# EAGLE schematic BreakoutBoard (EAGLE 9.6.2)
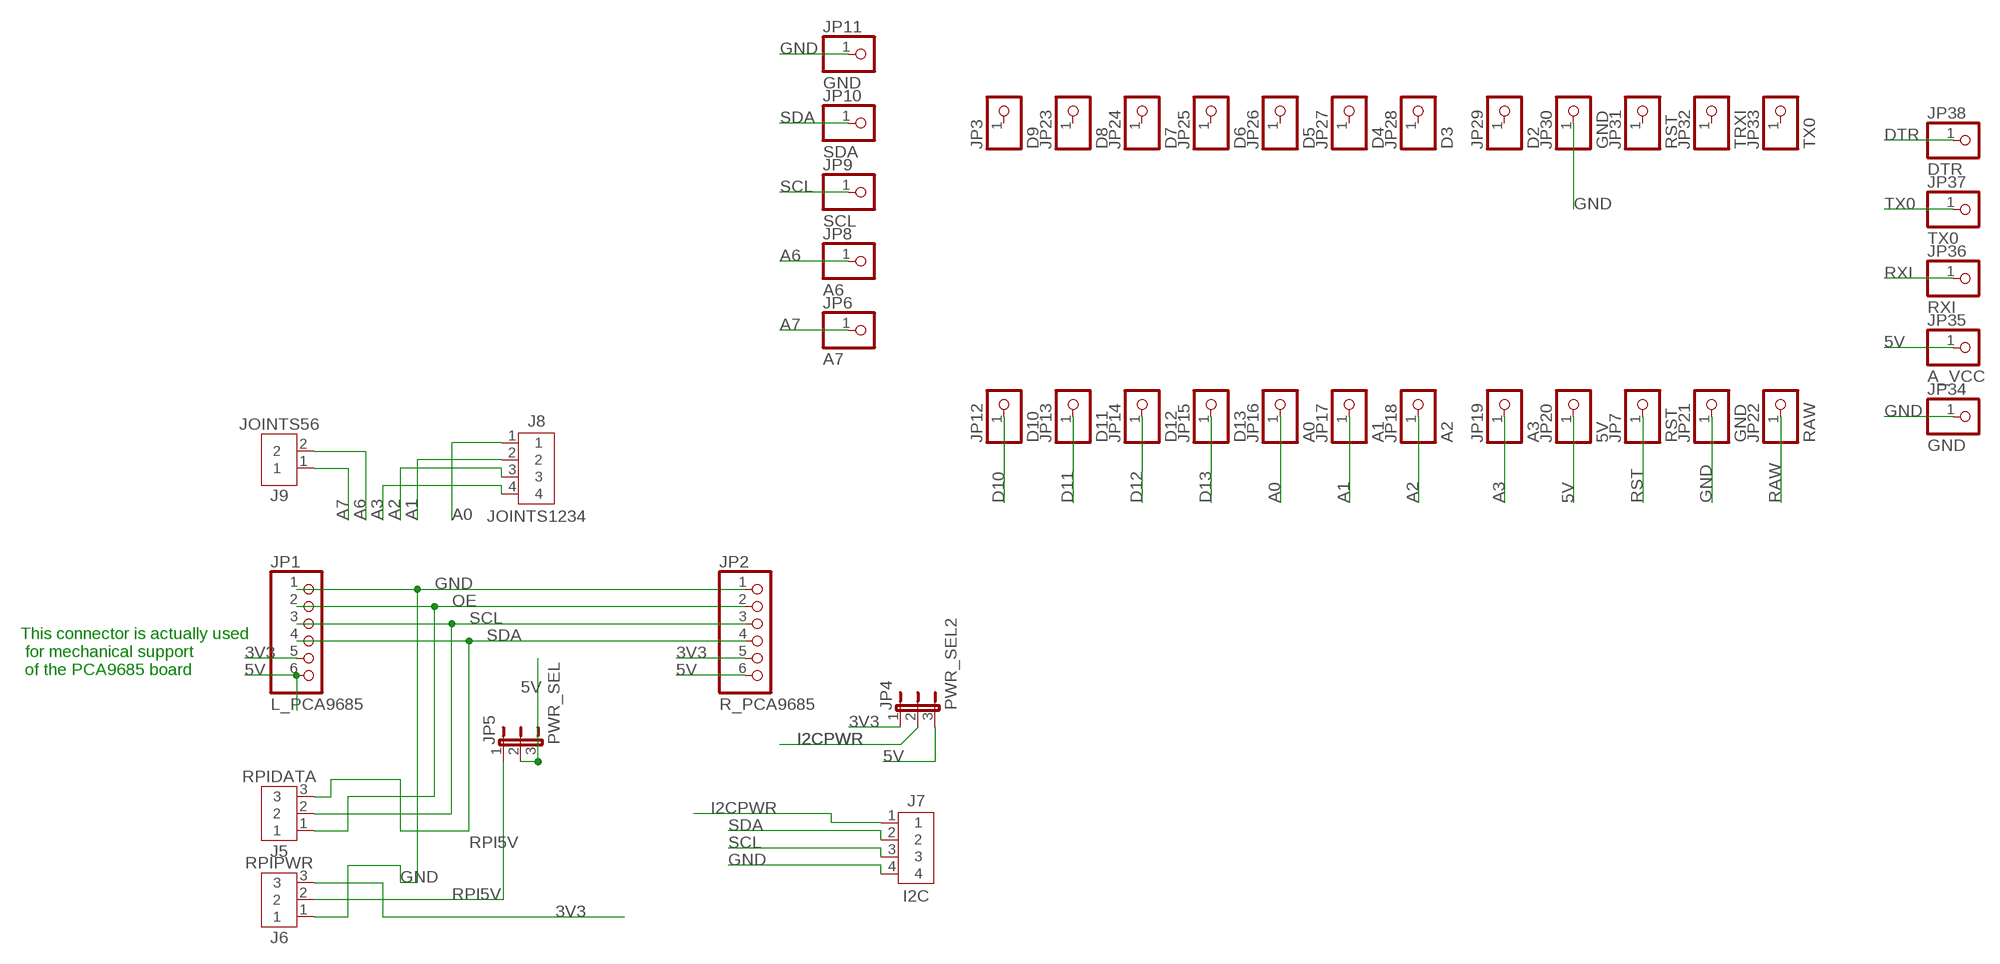
[diagram p0: schematic, sheet 1]

## Parts
J5  RPIDATA  B3B-XH-A  [B3B-XH-A]
J6  RPIPWR  B3B-XH-A  [B3B-XH-A]
J7  I2C  B4B-XH-A  [B4B-XH-A]
J8  JOINTS1234  B4B-XH-A  [B4B-XH-A]
J9  JOINTS56  B2B-XH-A  [B2B-XH-A]
JP1  L_PCA9685  PINHD-1X6  [1X06]
JP2  R_PCA9685  PINHD-1X6  [1X06]
JP3  D9  PINHD-1X1  [1X01]
JP4  PWR_SEL2  JP2E  [JP2]
JP5  PWR_SEL  JP2E  [JP2]
JP6  A7  PINHD-1X1  [1X01]
JP7  RST  PINHD-1X1  [1X01]
JP8  A6  PINHD-1X1  [1X01]
JP9  SCL  PINHD-1X1  [1X01]
JP10  SDA  PINHD-1X1  [1X01]
JP11  GND  PINHD-1X1  [1X01]
JP12  D10  PINHD-1X1  [1X01]
JP13  D11  PINHD-1X1  [1X01]
JP14  D12  PINHD-1X1  [1X01]
JP15  D13  PINHD-1X1  [1X01]
JP16  A0  PINHD-1X1  [1X01]
JP17  A1  PINHD-1X1  [1X01]
JP18  A2  PINHD-1X1  [1X01]
JP19  A3  PINHD-1X1  [1X01]
JP20  5V  PINHD-1X1  [1X01]
JP21  GND  PINHD-1X1  [1X01]
JP22  RAW  PINHD-1X1  [1X01]
JP23  D8  PINHD-1X1  [1X01]
JP24  D7  PINHD-1X1  [1X01]
JP25  D6  PINHD-1X1  [1X01]
JP26  D5  PINHD-1X1  [1X01]
JP27  D4  PINHD-1X1  [1X01]
JP28  D3  PINHD-1X1  [1X01]
JP29  D2  PINHD-1X1  [1X01]
JP30  GND  PINHD-1X1  [1X01]
JP31  RST  PINHD-1X1  [1X01]
JP32  TRXI  PINHD-1X1  [1X01]
JP33  TX0  PINHD-1X1  [1X01]
JP34  GND  PINHD-1X1  [1X01]
JP35  A_VCC  PINHD-1X1  [1X01]
JP36  RXI  PINHD-1X1  [1X01]
JP37  TX0  PINHD-1X1  [1X01]
JP38  DTR  PINHD-1X1  [1X01]

## Nets
3V3: J6.3 JP1.5 JP2.5 JP4.1
5V: JP1.6 JP2.6 JP4.3 JP5.2 JP5.3 JP20.1 JP35.1
A0: J8.1 JP16.1
A1: J8.2 JP17.1
A2: J8.3 JP18.1
A3: J8.4 JP19.1
A6: J9.2 JP8.1
A7: J9.1 JP6.1
D10: JP12.1
D11: JP13.1
D12: JP14.1
D13: JP15.1
DTR: JP38.1
GND: J6.1 J7.4 JP1.1 JP2.1 JP11.1 JP21.1 JP30.1 JP34.1
I2CPWR: J7.1 JP4.2
OE: J5.1 JP1.2 JP2.2
RAW: JP22.1
RPI5V: J6.2 JP5.1
RST: JP7.1
RXI: JP36.1
SCL: J5.2 J7.3 JP1.3 JP2.3 JP9.1
SDA: J5.3 J7.2 JP1.4 JP2.4 JP10.1
TX0: JP37.1
Unconnected: JP3.1 JP23.1 JP24.1 JP25.1 JP26.1 JP27.1 JP28.1 JP29.1 JP31.1 JP32.1 JP33.1

## Notes on the sheet
- This connector is actually used
   for mechanical support
   of the PCA9685 board

## Library data of the parts
J5 J6 = Connector:B3B-XH-A: XH Connector Top Entry - 3POS Details see: Datasheet <http://www.jst-mfg.com/product/pdf/eng/eXH.pdf>; CATEGORY: CONNECTOR; DESCRIPTION: 2.5mm pitch/disconnectable crimp style connector; MANUFACTURER: JST (XH connector); MPN: B3B-XH-A; PART_STATUS: ACTIVE; ROHS_COMPLIANT: COMPLIANT; SERIES: B3B-XH-A; SUB_CATEGORY: THROUGH HOLE CONNECTOR; TYPE: SIDE ENTRY; VALUE: 3A/250V
J7 J8 = Connector:B4B-XH-A: XH Connector Top Entry - 4POS Details see: Datasheet <http://www.jst-mfg.com/product/pdf/eng/eXH.pdf>; CATEGORY: CONNECTOR; DSECRIPTION: 2.5mm pitch/disconnctable crimp style connector; MANUFACTURER: JST (XH connector); MPN: B4B-XH-A; OPERATING_TEMPERATURE: -25 C to 85 C; PART_STATUS: ACTIVE; ROHS_COMPLIANT: COMPLAINT; SERIES: B4B-XH-A; SUB_CATEGORY: Through hole; TYPE: TOP ENTRY; VALUE: 3A/250V
J9 = Connector:B2B-XH-A: XH Connector Top Entry - 2POS Details see: Datasheet <http://www.jst-mfg.com/product/pdf/eng/eXH.pdf>; CATEGORY: CONNECTOR; DESCRIPTION: 2.5mm pitch/disconnectable crimp style connector; MANUFACTURER: JST (XH CONNECTOR); MPN: B2B-XH-A; OPERATING_TEMPERATURE: -25°C ~ 85°C; PART_STATUS: ACTIVE; ROHS_COMPLIANT: COMPLIANT; SERIES: B_B-XH-A; SUB_CATEGORY: Through hole connector; TYPE: top entry; VALUE: 3A/250V
JP1 JP2 = pinhead:PINHD-1X6: PIN HEADER
JP3 JP6-JP38 = Connector:PINHD-1X1: PIN HEADER; CATEGORY: CONNECTOR; SUB-CATEGORY: PIN-HEADER
JP4 JP5 = jumper:JP2E: JUMPER